# Altium schematic sheet DRAM_DDR4.SchDoc
size A3; SheetNumber: 12; SheetTotal: 21
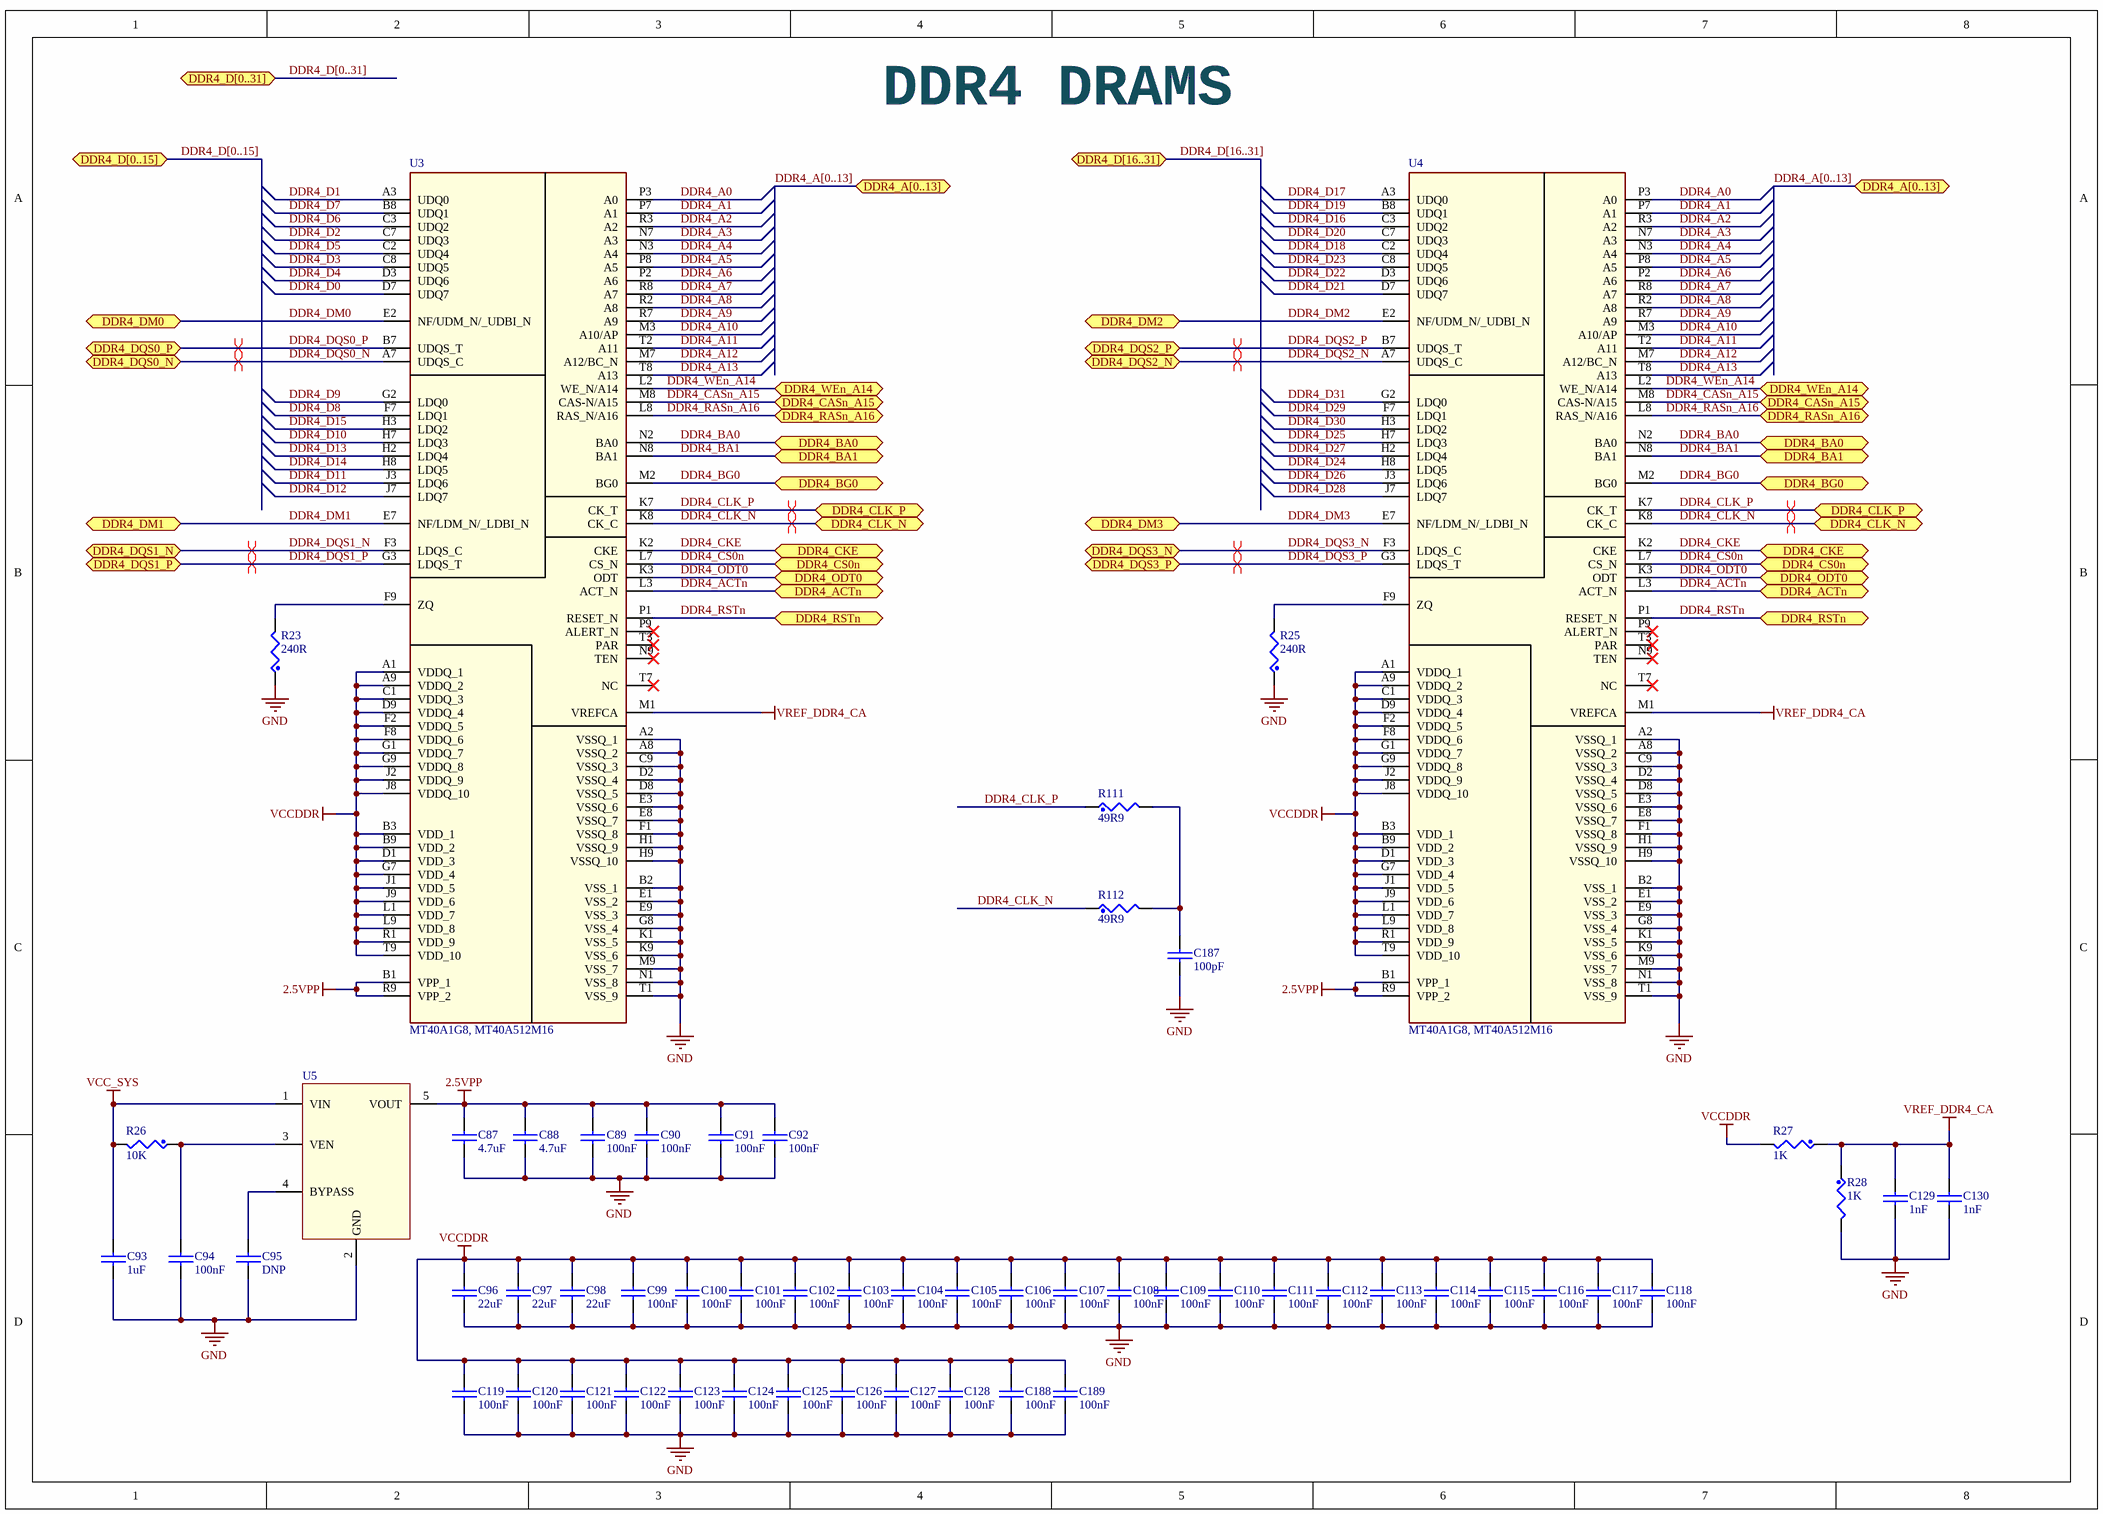
[diagram p0: DRAM_DDR4.SchDoc]

## Parts
C87  4.7uF  [0402_CC - C]
C88  4.7uF  [0402_CC - C]
C89  100nF  [0402_CC - C]
C90  100nF  [0402_CC - C]
C91  100nF  [0402_CC - C]
C92  100nF  [0402_CC - C]
C93  1uF  [0402_CC - C]
C94  100nF  [0402_CC - C]
C95  DNP  [0402_CC - C]
C96  22uF  [0603_CC]
C97  22uF  [0603_CC]
C98  22uF  [0603_CC]
C99  100nF  [0402_CC - C]
C100  100nF  [0402_CC - C]
C101  100nF  [0402_CC - C]
C102  100nF  [0402_CC - C]
C103  100nF  [0402_CC - C]
C104  100nF  [0402_CC - C]
C105  100nF  [0402_CC - C]
C106  100nF  [0402_CC - C]
C107  100nF  [0402_CC - C]
C108  100nF  [0402_CC - C]
C109  100nF  [0402_CC - C]
C110  100nF  [0402_CC - C]
C111  100nF  [0402_CC - C]
C112  100nF  [0402_CC - C]
C113  100nF  [0402_CC - C]
C114  100nF  [0402_CC - C]
C115  100nF  [0402_CC - C]
C116  100nF  [0402_CC - C]
C117  100nF  [0402_CC - C]
C118  100nF  [0402_CC - C]
C119  100nF  [0402_CC - C]
C120  100nF  [0402_CC - C]
C121  100nF  [0402_CC - C]
C122  100nF  [0402_CC - C]
C123  100nF  [0402_CC - C]
C124  100nF  [0402_CC - C]
C125  100nF  [0402_CC - C]
C126  100nF  [0402_CC - C]
C127  100nF  [0402_CC - C]
C128  100nF  [0402_CC - C]
C129  1nF  [0402_CC - C]
C130  1nF  [0402_CC - C]
C187  100pF  [0402_CC - C]
C188  100nF  [0402_CC - C]
C189  100nF  [0402_CC - C]
R23  240R  [0402_CR]
R25  240R  [0402_CR]
R26  10K  [0402_CR]
R27  1K  [0603_CR]
R28  1K  [0603_CR]
R111  49R9  [0402_CR]
R112  49R9  [0402_CR]
U3  MT40A1G8, MT40A512M16  [BGA96C80P9X16_1000X1400X120]
U4  MT40A1G8, MT40A512M16  [BGA96C80P9X16_1000X1400X120]
U5  LDO  [SOT23_5]  (value not drawn)

## Ports
DDR4_A[0..13] (bidir), DDR4_ACTn (bidir), DDR4_BA0 (bidir), DDR4_BA1 (bidir), DDR4_BG0 (bidir), DDR4_CASn_A15 (bidir), DDR4_CKE (bidir), DDR4_CLK_N (bidir), DDR4_CLK_P (bidir), DDR4_CS0n (bidir), DDR4_D[0..15] (bidir), DDR4_D[0..31] (bidir), DDR4_D[16..31] (bidir), DDR4_DM0 (bidir), DDR4_DM1 (bidir), DDR4_DM2 (bidir), DDR4_DM3 (bidir), DDR4_DQS0_N (bidir), DDR4_DQS0_P (bidir), DDR4_DQS1_N (bidir), DDR4_DQS1_P (bidir), DDR4_DQS2_N (bidir), DDR4_DQS2_P (bidir), DDR4_DQS3_N (bidir), DDR4_DQS3_P (bidir), DDR4_ODT0 (bidir), DDR4_RASn_A16 (bidir), DDR4_RSTn (bidir), DDR4_WEn_A14 (bidir)

## Nets
2.5VPP: C87.1 C88.1 C89.1 C90.1 C91.1 C92.1 U3.B1(VPP_1) U3.R9(VPP_2) U4.B1(VPP_1) U4.R9(VPP_2) U5.5(VOUT)
GND: C87.2 C88.2 C89.2 C90.2 C91.2 C92.2 C93.2 C94.2 C95.2 C96.2 C97.2 C98.2 C99.2 C100.2 C101.2 C102.2 C103.2 C104.2 C105.2 C106.2 C107.2 C108.2 C109.2 C110.2 C111.2 C112.2 C113.2 C114.2 C115.2 C116.2 C117.2 C118.2 C119.2 C120.2 C121.2 C122.2 C123.2 C124.2 C125.2 C126.2 C127.2 C128.2 C129.2 C130.2 C187.2 C188.2 C189.2 R23.1 R25.1 R28.2 U3.A2(VSSQ_1) U3.A8(VSSQ_2) U3.B2(VSS_1) U3.C9(VSSQ_3) U3.D2(VSSQ_4) U3.D8(VSSQ_5) U3.E1(VSS_2) U3.E3(VSSQ_6) U3.E8(VSSQ_7) U3.E9(VSS_3) U3.F1(VSSQ_8) U3.G8(VSS_4) U3.H1(VSSQ_9) U3.H9(VSSQ_10) U3.K1(VSS_5) U3.K9(VSS_6) U3.M9(VSS_7) U3.N1(VSS_8) U3.T1(VSS_9) U4.A2(VSSQ_1) U4.A8(VSSQ_2) U4.B2(VSS_1) U4.C9(VSSQ_3) U4.D2(VSSQ_4) U4.D8(VSSQ_5) U4.E1(VSS_2) U4.E3(VSSQ_6) U4.E8(VSSQ_7) U4.E9(VSS_3) U4.F1(VSSQ_8) U4.G8(VSS_4) U4.H1(VSSQ_9) U4.H9(VSSQ_10) U4.K1(VSS_5) U4.K9(VSS_6) U4.M9(VSS_7) U4.N1(VSS_8) U4.T1(VSS_9) U5.2(GND)
VCC_SYS: C93.1 R26.2 U5.1(VIN)
VCCDDR: C96.1 C97.1 C98.1 C99.1 C100.1 C101.1 C102.1 C103.1 C104.1 C105.1 C106.1 C107.1 C108.1 C109.1 C110.1 C111.1 C112.1 C113.1 C114.1 C115.1 C116.1 C117.1 C118.1 C119.1 C120.1 C121.1 C122.1 C123.1 C124.1 C125.1 C126.1 C127.1 C128.1 C188.1 C189.1 R27.2 U3.A1(VDDQ_1) U3.A9(VDDQ_2) U3.B3(VDD_1) U3.B9(VDD_2) U3.C1(VDDQ_3) U3.D1(VDD_3) U3.D9(VDDQ_4) U3.F2(VDDQ_5) U3.F8(VDDQ_6) U3.G1(VDDQ_7) U3.G7(VDD_4) U3.G9(VDDQ_8) U3.J1(VDD_5) U3.J2(VDDQ_9) U3.J8(VDDQ_10) U3.J9(VDD_6) U3.L1(VDD_7) U3.L9(VDD_8) U3.R1(VDD_9) U3.T9(VDD_10) U4.A1(VDDQ_1) U4.A9(VDDQ_2) U4.B3(VDD_1) U4.B9(VDD_2) U4.C1(VDDQ_3) U4.D1(VDD_3) U4.D9(VDDQ_4) U4.F2(VDDQ_5) U4.F8(VDDQ_6) U4.G1(VDDQ_7) U4.G7(VDD_4) U4.G9(VDDQ_8) U4.J1(VDD_5) U4.J2(VDDQ_9) U4.J8(VDDQ_10) U4.J9(VDD_6) U4.L1(VDD_7) U4.L9(VDD_8) U4.R1(VDD_9) U4.T9(VDD_10)
VREF_DDR4_CA: C129.1 C130.1 R27.1 R28.1 U3.M1(VREFCA) U4.M1(VREFCA)
DDR4_A0: U3.P3(A0) U4.P3(A0)
DDR4_A1: U3.P7(A1) U4.P7(A1)
DDR4_A2: U3.R3(A2) U4.R3(A2)
DDR4_A3: U3.N7(A3) U4.N7(A3)
DDR4_A4: U3.N3(A4) U4.N3(A4)
DDR4_A5: U3.P8(A5) U4.P8(A5)
DDR4_A6: U3.P2(A6) U4.P2(A6)
DDR4_A7: U3.R8(A7) U4.R8(A7)
DDR4_A8: U3.R2(A8) U4.R2(A8)
DDR4_A9: U3.R7(A9) U4.R7(A9)
DDR4_A10: U3.M3(A10/AP) U4.M3(A10/AP)
DDR4_A11: U3.T2(A11) U4.T2(A11)
DDR4_A12: U3.M7(A12/BC_N) U4.M7(A12/BC_N)
DDR4_A13: U3.T8(A13) U4.T8(A13)
DDR4_ACTn: U3.L3(ACT_N) U4.L3(ACT_N) ; port DDR4_ACTn
DDR4_BA0: U3.N2(BA0) U4.N2(BA0) ; port DDR4_BA0
DDR4_BA1: U3.N8(BA1) U4.N8(BA1) ; port DDR4_BA1
DDR4_BG0: U3.M2(BG0) U4.M2(BG0) ; port DDR4_BG0
DDR4_CASn_A15: U3.M8(CAS-N/A15) U4.M8(CAS-N/A15) ; port DDR4_CASn_A15
DDR4_CKE: U3.K2(CKE) U4.K2(CKE) ; port DDR4_CKE
DDR4_CLK_N: R112.1 U3.K8(CK_C) U4.K8(CK_C) ; port DDR4_CLK_N
DDR4_CLK_P: R111.1 U3.K7(CK_T) U4.K7(CK_T) ; port DDR4_CLK_P
DDR4_CS0n: U3.L7(CS_N) U4.L7(CS_N) ; port DDR4_CS0n
DDR4_D0: U3.D7(UDQ7)
DDR4_D1: U3.A3(UDQ0)
DDR4_D2: U3.C7(UDQ3)
DDR4_D3: U3.C8(UDQ5)
DDR4_D4: U3.D3(UDQ6)
DDR4_D5: U3.C2(UDQ4)
DDR4_D6: U3.C3(UDQ2)
DDR4_D7: U3.B8(UDQ1)
DDR4_D8: U3.F7(LDQ1)
DDR4_D9: U3.G2(LDQ0)
DDR4_D10: U3.H7(LDQ3)
DDR4_D11: U3.J3(LDQ6)
DDR4_D12: U3.J7(LDQ7)
DDR4_D13: U3.H2(LDQ4)
DDR4_D14: U3.H8(LDQ5)
DDR4_D15: U3.H3(LDQ2)
DDR4_D16: U4.C3(UDQ2)
DDR4_D17: U4.A3(UDQ0)
DDR4_D18: U4.C2(UDQ4)
DDR4_D19: U4.B8(UDQ1)
DDR4_D20: U4.C7(UDQ3)
DDR4_D21: U4.D7(UDQ7)
DDR4_D22: U4.D3(UDQ6)
DDR4_D23: U4.C8(UDQ5)
DDR4_D24: U4.H8(LDQ5)
DDR4_D25: U4.H7(LDQ3)
DDR4_D26: U4.J3(LDQ6)
DDR4_D27: U4.H2(LDQ4)
DDR4_D28: U4.J7(LDQ7)
DDR4_D29: U4.F7(LDQ1)
DDR4_D30: U4.H3(LDQ2)
DDR4_D31: U4.G2(LDQ0)
DDR4_DM0: U3.E2(NF/UDM_N/_UDBI_N) ; port DDR4_DM0
DDR4_DM1: U3.E7(NF/LDM_N/_LDBI_N) ; port DDR4_DM1
DDR4_DM2: U4.E2(NF/UDM_N/_UDBI_N) ; port DDR4_DM2
DDR4_DM3: U4.E7(NF/LDM_N/_LDBI_N) ; port DDR4_DM3
DDR4_DQS0_N: U3.A7(UDQS_C) ; port DDR4_DQS0_N
DDR4_DQS0_P: U3.B7(UDQS_T) ; port DDR4_DQS0_P
DDR4_DQS1_N: U3.F3(LDQS_C) ; port DDR4_DQS1_N
DDR4_DQS1_P: U3.G3(LDQS_T) ; port DDR4_DQS1_P
DDR4_DQS2_N: U4.A7(UDQS_C) ; port DDR4_DQS2_N
DDR4_DQS2_P: U4.B7(UDQS_T) ; port DDR4_DQS2_P
DDR4_DQS3_N: U4.F3(LDQS_C) ; port DDR4_DQS3_N
DDR4_DQS3_P: U4.G3(LDQS_T) ; port DDR4_DQS3_P
DDR4_ODT0: U3.K3(ODT) U4.K3(ODT) ; port DDR4_ODT0
DDR4_RASn_A16: U3.L8(RAS_N/A16) U4.L8(RAS_N/A16) ; port DDR4_RASn_A16
DDR4_RSTn: U3.P1(RESET_N) U4.P1(RESET_N) ; port DDR4_RSTn
DDR4_WEn_A14: U3.L2(WE_N/A14) U4.L2(WE_N/A14) ; port DDR4_WEn_A14
NetC94_1: C94.1 R26.1 U5.3(VEN)
NetC95_1: C95.1 U5.4(BYPASS)
NetC187_1: C187.1 R111.2 R112.2
NetR23_2: R23.2 U3.F9(ZQ)
NetR25_2: R25.2 U4.F9(ZQ)

Not connected (* = marked no-connect by the designer): U3 N9(TEN)* P9(ALERT_N)* T3(PAR)* T7(NC)*; U4 N9(TEN)* P9(ALERT_N)* T3(PAR)* T7(NC)*

## Buses and harness runs
bus DDR4_A[0..13] = port DDR4_A[0..13]
bus DDR4_D[0..15] = port DDR4_D[0..15]
bus DDR4_D[0..31] = port DDR4_D[0..31]
bus DDR4_D[16..31] = port DDR4_D[16..31]

## Layout directives
differential pair: DDR4_CLK_N, DDR4_CLK_P, DDR4_DQS0_N, DDR4_DQS0_P, DDR4_DQS1_N, DDR4_DQS1_P, DDR4_DQS2_N, DDR4_DQS2_P, DDR4_DQS3_N, DDR4_DQS3_P

## Notes on the sheet
- DDR4 DRAMS

## Library data of the parts
C87-C130 C187-C189 = CAP_NP: CLASS: DISCRETE
R23 R25-R28 R111 R112 = RES: CLASS: DISCRETE
U3 U4 = MT40A1G8: AAR, MT40A, DDR4 , 96-Ball x16; Manufacturer_Name: Micron; Manufacturer_Part_Number: MT40A1G16HBA-083E; Datasheet Link: https://pdf1.alldatasheet.com/datasheet-pdf/view/928214/MICRON/MT40A1G16HBA-083E.html; Height: 1.2mm; Package/Case: FBGA96
U5 = PT5108: PT5108  , High-PSRR 500mA LDO, By AAR